# Altium schematic sheet Tray3.SchDoc
size A4
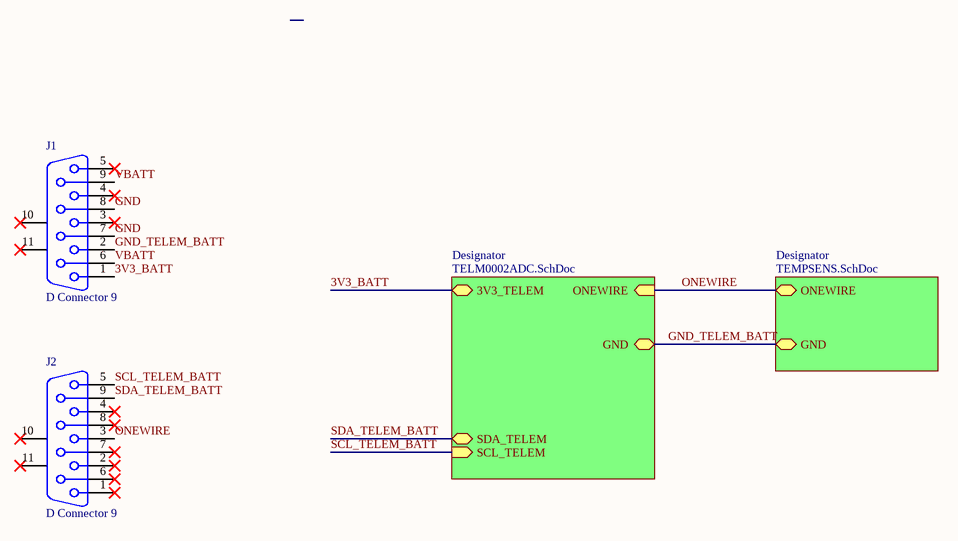
[diagram p0: Tray3.SchDoc]

## Parts
J1  D Connector 9  [DSUB1.385-2H9]
J2  D Connector 9  [DSUB1.385-2H9]

## Sub-sheets
Designator = TELM0002ADC.SchDoc: 3V3_TELEM, SDA_TELEM (bidir), ONEWIRE (in), GND, SCL_TELEM (in)
Designator = TEMPSENS.SchDoc: ONEWIRE (bidir), GND

## Nets
3V3_BATT: J1.1 ; sheet Designator/3V3_TELEM
GND: J1.7 J1.8
GND_TELEM_BATT: J1.2 ; sheet Designator/GND, sheet Designator/GND
ONEWIRE: J2.3 ; sheet Designator/ONEWIRE, sheet Designator/ONEWIRE
SCL_TELEM_BATT: J2.5 ; sheet Designator/SCL_TELEM
SDA_TELEM_BATT: J2.9 ; sheet Designator/SDA_TELEM
VBATT: J1.6 J1.9

Not connected (* = marked no-connect by the designer): J1 3* 4* 5* 10(MH1)* 11(MH2)*; J2 1* 2* 4* 6* 7* 8* 10(MH1)* 11(MH2)*

## Library data of the parts
J1 J2 = D Connector 9: Receptacle Assembly, 9 Position, Right Angle; PackageDocument: O; Positions: 9; Published: 15-Jun-2001; LatestRevisionDate: 17-Jul-2002; LatestRevisionNote: Re-released for DXP Platform.; DatasheetDocument: 1-Sep-1999; PackageReference: 788750; Publisher: Altium Limited; Orientation: Right Angle; Gender: Receptacle